# EAGLE design working (EAGLE 5.12)
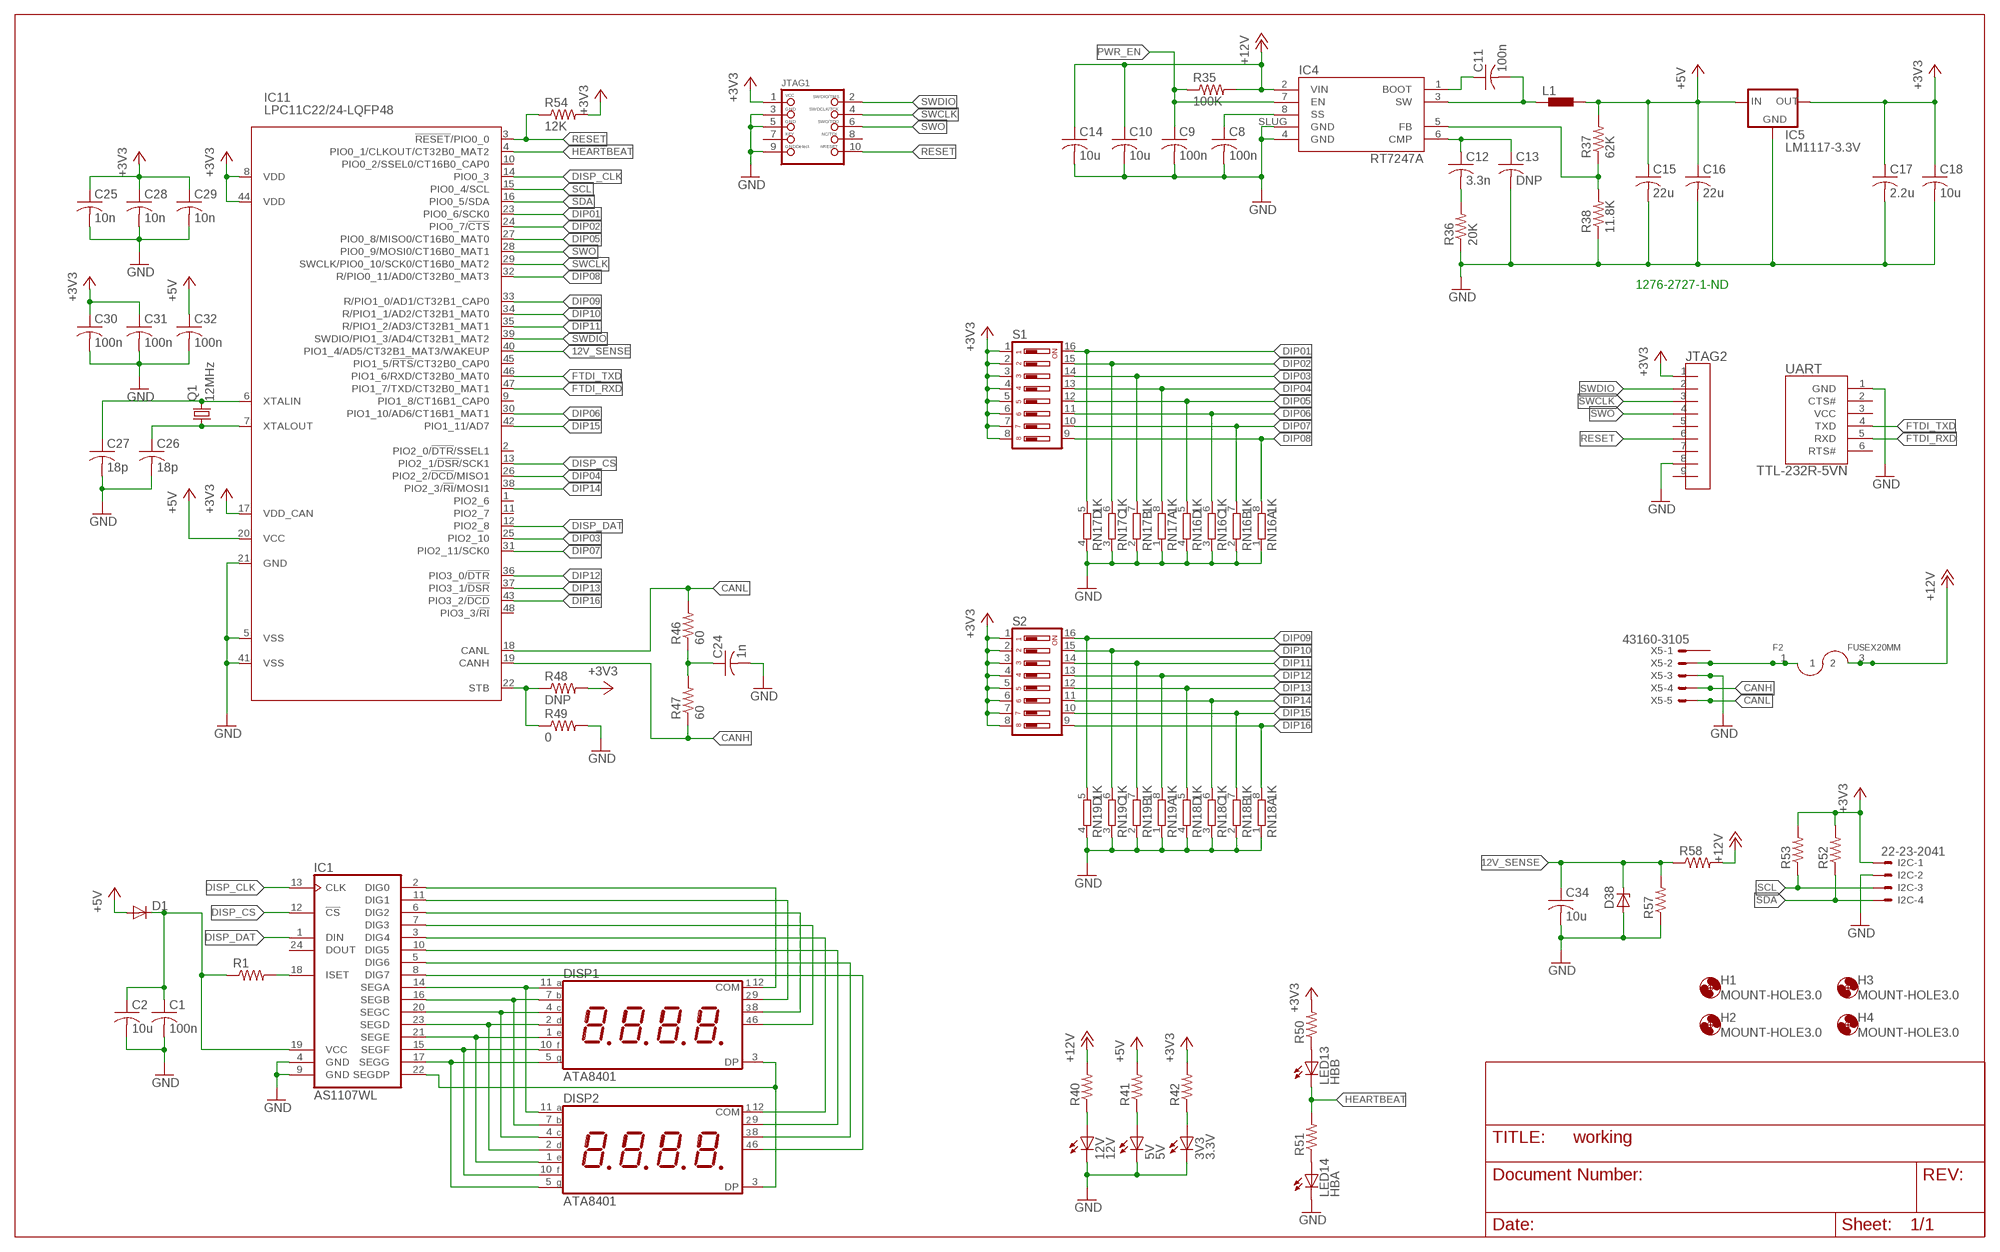
[diagram p0: schematic, sheet 1]

## Parts
3V3  3.3V  LEDCHIP-LED0805  [CHIP-LED0805]
5V  5V  LEDCHIP-LED0805  [CHIP-LED0805]
12V  12V  LEDCHIP-LED0805  [CHIP-LED0805]
C1  100n  C-USC0603  [C0603]
C2  10u  C-USC1206  [C1206]
C8  100n  C-USC0603  [C0603]
C9  100n  C-USC0603  [C0603]
C10  10u  C-USC1206  [C1206]
C11  100n  C-USC0603  [C0603]
C12  3.3n  C-USC0603  [C0603]
C13  DNP  C-USC0603  [C0603]
C14  10u  C-USC1206  [C1206]
C15  22u  C-USC1206  [C1206]
C16  22u  C-USC1206  [C1206]
C17  2.2u  C-USC0805  [C0805]
C18  10u  C-USC1206  [C1206]
C24  1n  C-USC0603  [C0603]
C25  10n  C-USC0603  [C0603]
C26  18p  C-USC0603  [C0603]
C27  18p  C-USC0603  [C0603]
C28  10n  C-USC0603  [C0603]
C29  10n  C-USC0603  [C0603]
C30  100n  C-USC0603  [C0603]
C31  100n  C-USC0603  [C0603]
C32  100n  C-USC0603  [C0603]
C34  10u  C-USC1206  [C1206]
D1  DIODESMA  [SMA-DIODE]
D38  ZENER-DIODESOD80C  [SOD80C]
DISP1  ATA8401  [ATA8401]
DISP2  ATA8401  [ATA8401]
F2  FUSEX20MM  [FUSE_5MM]
H1  MOUNT-HOLE3.0  [3,0]
H2  MOUNT-HOLE3.0  [3,0]
H3  MOUNT-HOLE3.0  [3,0]
H4  MOUNT-HOLE3.0  [3,0]
I2C  22-23-2041  [22-23-2041]
IC1  AS1107WL  [SOIC-24]
IC4  RT7247A  [SO08]
IC5  LM1117-3.3V  LM1117  [SOT223]
IC11  LPC11C22/24-LQFP48  [LQFP48]
JTAG1  JTAG-CORTEXM3  [2X05_1.27MM_SMT]
JTAG2  M09-100MIL  [100MIL-9]
L1  DR1030  [DR1030]
LED13  HBB  LEDCHIP-LED0805  [CHIP-LED0805]
LED14  HBA  LEDCHIP-LED0805  [CHIP-LED0805]
Q1  12MHz  CRYSTALHC49UP  [HC49UP]
R1  R-US_R0603  [R0603]
R35  100K  R-US_R0603  [R0603]
R36  20K  R-US_R0603  [R0603]
R37  62K  R-US_R0603  [R0603]
R38  11.8K  R-US_R0603  [R0603]
R40  R-US_R0603  [R0603]
R41  R-US_R0603  [R0603]
R42  R-US_R0603  [R0603]
R46  60  R-US_R0603  [R0603]
R47  60  R-US_R0603  [R0603]
R48  DNP  R-US_R0603  [R0603]
R49  0  R-US_R0603  [R0603]
R50  R-US_R0603  [R0603]
R51  R-US_R0603  [R0603]
R52  R-US_R0603  [R0603]
R53  R-US_R0603  [R0603]
R54  12K  R-US_R0603  [R0603]
R57  R-US_R0603  [R0603]
R58  R-US_R0603  [R0603]
RN16  1K  4R-NEXBS8V  [EXBS8V]
RN17  1K  4R-NEXBS8V  [EXBS8V]
RN18  1K  4R-NEXBS8V  [EXBS8V]
RN19  1K  4R-NEXBS8V  [EXBS8V]
S1  DS08  [DS-08]
S2  DS08  [DS-08]
UART  TTL-232R-5VN  [USBCABLE-0.100-NOLBL]
X5  43160-3105  [43160-XX05]

## Nets
12V_SENSE: C34.1 D38.C IC11.40(PIO1_4/AD5/CT32B1_MAT3/WAKEUP) R57.2 R58.1
+3V3: C17.1 C18.1 C25.1 C28.1 C29.1 C30.1 C31.1 I2C.1 IC5.2(OUT) IC11.8(VDD) IC11.17(VDD_CAN) IC11.44(VDD) JTAG1.1 JTAG2.1 R42.2 R48.2 R50.2 R52.2 R53.2 R54.2 S1.1 S1.2 S1.3 S1.4 S1.5 S1.6 S1.7 S1.8 S2.1 S2.2 S2.3 S2.4 S2.5 S2.6 S2.7 S2.8
+5V: C15.1 C16.1 C32.1 D1.A IC5.3(IN) IC11.20(VCC) L1.2 R37.2 R41.2
+12V: C10.1 C14.1 F2.3 F2.4(2B) IC4.2(VIN) R35.2 R40.2 R58.2
CANH: IC11.19(CANH) R47.1 X5.4@1(-4:S) X5.4@2(-4:S)
CANL: IC11.18(CANL) R46.2 X5.5@1(-5:S) X5.5@2(-5:S)
DIP01: IC11.23(PIO0_6/SCK0) RN17.5 S1.16
DIP02: IC11.24(PIO0_7/!CTS!) RN17.6 S1.15
DIP03: IC11.25(PIO2_10) RN17.7 S1.14
DIP04: IC11.26(PIO2_2/!DCD!/MISO1) RN17.8 S1.13
DIP05: IC11.27(PIO0_8/MISO0/CT16B0_MAT0) RN16.5 S1.12
DIP06: IC11.30(PIO1_10/AD6/CT16B1_MAT1) RN16.6 S1.11
DIP07: IC11.31(PIO2_11/SCK0) RN16.7 S1.10
DIP08: IC11.32(R/PIO0_11/AD0/CT32B0_MAT3) RN16.8 S1.9
DIP09: IC11.33(R/PIO1_0/AD1/CT32B1_CAP0) RN19.5 S2.16
DIP10: IC11.34(R/PIO1_1/AD2/CT32B1_MAT0) RN19.6 S2.15
DIP11: IC11.35(R/PIO1_2/AD3/CT32B1_MAT1) RN19.7 S2.14
DIP12: IC11.36(PIO3_0/!DTR!) RN19.8 S2.13
DIP13: IC11.37(PIO3_1/!DSR!) RN18.5 S2.12
DIP14: IC11.38(PIO2_3/!RI!/MOSI1) RN18.6 S2.11
DIP15: IC11.42(PIO1_11/AD7) RN18.7 S2.10
DIP16: IC11.43(PIO3_2/!DCD!) RN18.8 S2.9
DISP_CLK: IC1.13(CLK) IC11.14(PIO0_3)
DISP_CS: IC1.12(!CS) IC11.13(PIO2_1/!DSR!/SCK1)
DISP_DAT: IC1.1(DIN) IC11.12(PIO2_8)
FTDI_RXD: IC11.47(PIO1_7/TXD/CT32B0_MAT1) UART.5(RXD)
FTDI_TXD: IC11.46(PIO1_6/RXD/CT32B0_MAT0) UART.4(TXD)
GND: 3V3.C 5V.C 12V.C C1.2 C2.2 C8.2 C9.2 C10.2 C13.2 C14.2 C15.2 C16.2 C17.2 C18.2 C24.2 C25.2 C26.2 C27.2 C28.2 C29.2 C30.2 C31.2 C32.2 C34.2 D38.A I2C.2 IC1.4(GND) IC1.9(GND) IC4.4(GND) IC4.SLUG(GND) IC5.1(GND) IC11.5(VSS) IC11.21(GND) IC11.41(VSS) JTAG1.3 JTAG1.5 JTAG1.9 JTAG2.8 LED14.C R36.1 R38.1 R49.2 R57.1 RN16.1 RN16.2 RN16.3 RN16.4 RN17.1 RN17.2 RN17.3 RN17.4 RN18.1 RN18.2 RN18.3 RN18.4 RN19.1 RN19.2 RN19.3 RN19.4 UART.1(GND) X5.3@1(-3:S) X5.3@2(-3:S)
HEARTBEAT: IC11.4(PIO0_1/CLKOUT/CT32B0_MAT2) LED13.C R51.2
N$1: DISP1.11(A) DISP2.11(A) IC1.14(SEGA)
N$2: DISP1.7(B) DISP2.7(B) IC1.16(SEGB)
N$3: DISP1.4(C) DISP2.4(C) IC1.20(SEGC)
N$4: DISP1.2(D) DISP2.2(D) IC1.23(SEGD)
N$5: DISP1.1(E) DISP2.1(E) IC1.21(SEGE)
N$6: DISP1.10(F) DISP2.10(F) IC1.15(SEGF)
N$7: DISP1.5(G) DISP2.5(G) IC1.17(SEGG)
N$8: DISP1.3(DP) DISP2.3(DP) IC1.22(SEGDP)
N$9: IC1.18(ISET) R1.2
N$10: DISP1.12(COM1) IC1.2(DIG0)
N$11: DISP1.9(COM2) IC1.11(DIG1)
N$12: DISP1.8(COM3) IC1.6(DIG2)
N$13: DISP1.6(COM4) IC1.7(DIG3)
N$14: DISP2.12(COM1) IC1.3(DIG4)
N$15: DISP2.9(COM2) IC1.10(DIG5)
N$16: DISP2.8(COM3) IC1.5(DIG6)
N$17: DISP2.6(COM4) IC1.8(DIG7)
N$19: C1.1 C2.1 D1.C IC1.19(VCC) R1.1
N$69: F2.1 F2.2(1B) X5.2@1(-2:S) X5.2@2(-2:S)
N$91: 12V.A R40.1
N$92: C8.1 IC4.8(SS)
N$95: C11.1 IC4.1(BOOT)
N$96: C11.2 IC4.3(SW) L1.1
N$97: C12.1 C13.1 IC4.6(CMP)
N$98: C12.2 R36.2
N$99: IC4.5(FB) R37.1 R38.2
N$100: 5V.A R41.1
N$101: 3V3.A R42.1
N$103: IC11.22(STB) R48.1 R49.1
N$121: C26.1 IC11.7(XTALOUT) Q1.1
N$122: C24.1 R46.1 R47.2
N$123: C27.1 IC11.6(XTALIN) Q1.2
N$126: LED13.A R50.1
N$127: LED14.A R51.1
PWR_EN: C9.1 IC4.7(EN) R35.1
RESET: IC11.3(!RESET!/PIO0_0) JTAG1.10 JTAG2.6 R54.1
SCL: I2C.3 IC11.15(PIO0_4/SCL) R53.1
SDA: I2C.4 IC11.16(PIO0_5/SDA) R52.1
SWCLK: IC11.29(SWCLK/PIO0_10/SCK0/CT16B0_MAT2) JTAG1.4 JTAG2.3
SWDIO: IC11.39(SWDIO/PIO1_3/AD4/CT32B1_MAT2) JTAG1.2 JTAG2.2
SWO: IC11.28(PIO0_9/MOSI0/CT16B0_MAT1) JTAG1.6 JTAG2.4
Unconnected: IC1.24(DOUT) IC11.1(PIO2_6) IC11.2(PIO2_0/!DTR!/SSEL1) IC11.9(PIO1_8/CT16B1_CAP0) IC11.10(PIO0_2/SSEL0/CT16B0_CAP0) IC11.11(PIO2_7) IC11.45(PIO1_5/!RTS!/CT32B0_CAP0) IC11.48(PIO3_3/!RI!) JTAG1.7 JTAG1.8 JTAG2.5 JTAG2.7 JTAG2.9 UART.2(CTS#) UART.3(VCC) UART.6(RTS#) X5.1@1(-1:S) X5.1@2(-1:S)

## Notes on the sheet
- 1276-2727-1-ND

## Library data of the parts
3V3 5V 12V LED13 LED14 = led:LED: LED OSRAM: - CHIPLED LG R971, LG N971, LY N971, LG Q971, LY Q971, LO R971, LY R971 LH N974, LH R974 LS Q976, LO Q976, LY Q976 LO Q996 - Hyper CHIPLED LW Q18S LB Q993, LB Q99A, LB R99A - SideLED LS A670, LO A670, LY A670, LG A670, LP A670 LB A673, LV A673, LT A673, LW A673 LH A674 LY A675 LS A676, LA A676, LO A676, LY A676, LW A676 LS A679, LY A679, LG A679 - Hyper Micro SIDELED® LS Y876, LA Y876, LO Y876, LY Y876 LT Y87S - SmartLED LW L88C, LW L88S LB L89C, LB L89S, LG L890 LS L89K, LO L89K, LY L89K LS L896, LA L896, LO L896, LY L896 - TOPLED LS T670, LO T670, LY T670, LG T670, LP T670 LSG T670, LSP T670, LSY T670, LOP T670, LYG T670 LG T671, LOG T671, LSG T671 LB T673, LV T673, LT T673, LW T673 LH T674 LS T676, LA T676, LO T676, LY T676, LB T676, LH T676, LSB T676, LW T676 LB T67C, LV T67C, LT T67C, LS T67K, LO T67K, LY T67K, LW E67C LS E67B, LA E67B, LO E67B, LY E67B, LB E67C, LV E67C, LT E67C LW T67C LS T679, LY T679, LG T679 LS T770, LO T770, LY T770, LG T770, LP T770 LB T773, LV T773, LT T773, LW T773 LH T774 LS E675, LA E675, LY E675, LS T675 LS T776, LA T776, LO T776, LY T776, LB T776 LHGB T686 LT T68C, LB T68C - Hyper Mini TOPLED® LB M676 - Mini TOPLED Santana® LG M470 LS M47K, LO M47K, LY M47K Source: http://www.osram.convergy.de LUXEON: - LUMILED® LXK2-PW12-R00, LXK2-PW12-S00, LXK2-PW14-U00, LXK2-PW14-V00 LXK2-PM12-R00, LXK2-PM12-S00, LXK2-PM14-U00 LXK2-PE12-Q00, LXK2-PE12-R00, LXK2-PE12-S00, LXK2-PE14-T00, LXK2-PE14-U00 LXK2-PB12-K00, LXK2-PB12-L00, LXK2-PB12-M00, LXK2-PB14-N00, LXK2-PB14-P00, LXK2-PB14-Q00 LXK2-PR12-L00, LXK2-PR12-M00, LXK2-PR14-Q00, LXK2-PR14-R00 LXK2-PD12-Q00, LXK2-PD12-R00, LXK2-PD12-S00 LXK2-PH12-R00, LXK2-PH12-S00 LXK2-PL12-P00, LXK2-PL12-Q00, LXK2-PL12-R00 Source: www.luxeon.com KINGBRIGHT: KA-3528ASYC Source: www.kingbright.com
C1 C2 C8-C18 C24-C32 C34 = rcl:C-US: CAPACITOR, American symbol
D1 = SparkFun:DIODE: Diode These are standard reverse protection diodes and small signal diodes. SMA package can handle up to about 1A. SOD-323 can handle about 200mA. What the SOD-323 package when ordering, there are some mfgs out there that are 5-pin packages.
D38 = diode:ZENER-DIODE: Z-Diode
DISP1 DISP2 = rbg-sfe-sevenseg:ATA8401
F2 = SparkFun:FUSE
H1-H4 = holes:MOUNT-HOLE: MOUNTING HOLE with drill center marker
I2C = con-molex:22-23-2041: .100" (2.54mm) Center Header - 4 Pin; MF: MOLEX; MPN: 22-23-2041; OC_FARNELL: 1462920; OC_NEWARK: 38C0355
IC1 = rbg-ams-displaydrive:AS1107WL
IC4 = rbg-richtek-vreg:RT7247A
IC5 = v-reg-3:LM1117
IC11 = lpc1100v1.1:LPC11C22/24-LQFP48: NXP Semiconductors LPC11Cxx microcontrollers <http://ics.nxp.com/products/lpc1000/lpc11xx/lpc11cxx/> ARM 32-bit Cortex-M0 Microcontroller with MPU CPU clock up to 50MHz 32KByte on-chip Flash ROM with In-System Programming (ISP) and In-Application Programming (IAP) via On-Chip Bootloader 8KByte SRAM Nested Vectored Interrupt Controller 2 SPI controllers CAN controller On-chip, high-speed CAN transciever UART with full Modem Interface and RS485 Support Fast Mode I2C-Bus 4 Timers with 4 capture channels and 12 output channels Watchdog (WDT) Sytem tick timer 10-bit ADC with 8 channels Power Management Unit (PMU) Brownout detection 12MHz internal RC oscillator Serial Wire Debug/Trace port
JTAG1 = microbuilder:JTAG-CORTEXM3: Serial Wire (SW-DP) Connector This standard 0.05" 10-pin connector is for use with the Cortex M0/M3's native SWD (serial wire debugger) interface (SW-DP). Some boards support a 20-pin combined JTAG+SWD connector (SWJ-DP), such as the LPC1700 family, but many smaller devices only work with SWD which typically use the smaller 10-pin SW-DP connecter (the LPC1300 family, for example, only supports SWD). 2x05 1.27mm/0.05" Connector: This is the standard SMT connector defined by ARM for all Cortex devices, and should be used in most situations and for forward-compatibility since any new devices coming to market will likely use this connector. MOLEX 10 Pin 0.1" Connector: This 0.1" 10 pin connector has the same pin layout as the standard 0.05" connector, but is easier to work with if you are using standard jumper wires or custom cables to connect your SWD hardware. MOLEX 20 Pin 0.1" Connector: This 0.1" 20 pin connector is the same model used for ARM7/ARM9 JTAG debuggers, but is connected to match the pins on the Segger J-Link for ARM (which supports both JTAG and SWD debugging). See the following document from ARM for more information on Cortex M3 Debug Connectors: http://infocenter.arm.com/help/topic/com.arm.doc.faqs/attached/13634/cortex_debug_connectors.pdf And the following page for an overview with images of the different connector types: http://www.keil.com/peripherals/coresight/connectors.asp
JTAG2 = rbg-generic-headers:M09-100MIL
L1 = inductors:DR1030: DR1030 Series Low Profile Power Inductors Source: Data sheet <http://www.cooperbussmann.com/pdf/c73e479f-f867-4c64-ae26-9c1f23814163.pdf>
Q1 = crystal:CRYSTAL: CRYSTAL; OC_FARNELL: unknown; OC_NEWARK: unknown
R1 R35-R38 R40-R42 R46-R54 R57 R58 = rcl:R-US_: RESISTOR, American symbol
RN16-RN19 = resistor-dil:4R-N: Array Chip Resistor Source: RS Component / Phycomp; OC_FARNELL: unknown; OC_NEWARK: unknown
S1 S2 = switch-dil:DS08: DIL/CODE SWITCH; MPN: DS08; OC_FARNELL: unknown; OC_NEWARK: 73J0071
UART = rbg-ftdi-usb:TTL-232R-5V
X5 = con-molex:43160-*05: SDA-43160 Connector Source: http://www.molex.com/pdm_docs/sd/431601306_sd.pdf; MF: WALDOM/MOLEX; MPN: 43160-3105; OC_FARNELL: unknown; OC_NEWARK: 54H0267

## Net classes
1 HV: clearance 0.406 mm

## Board
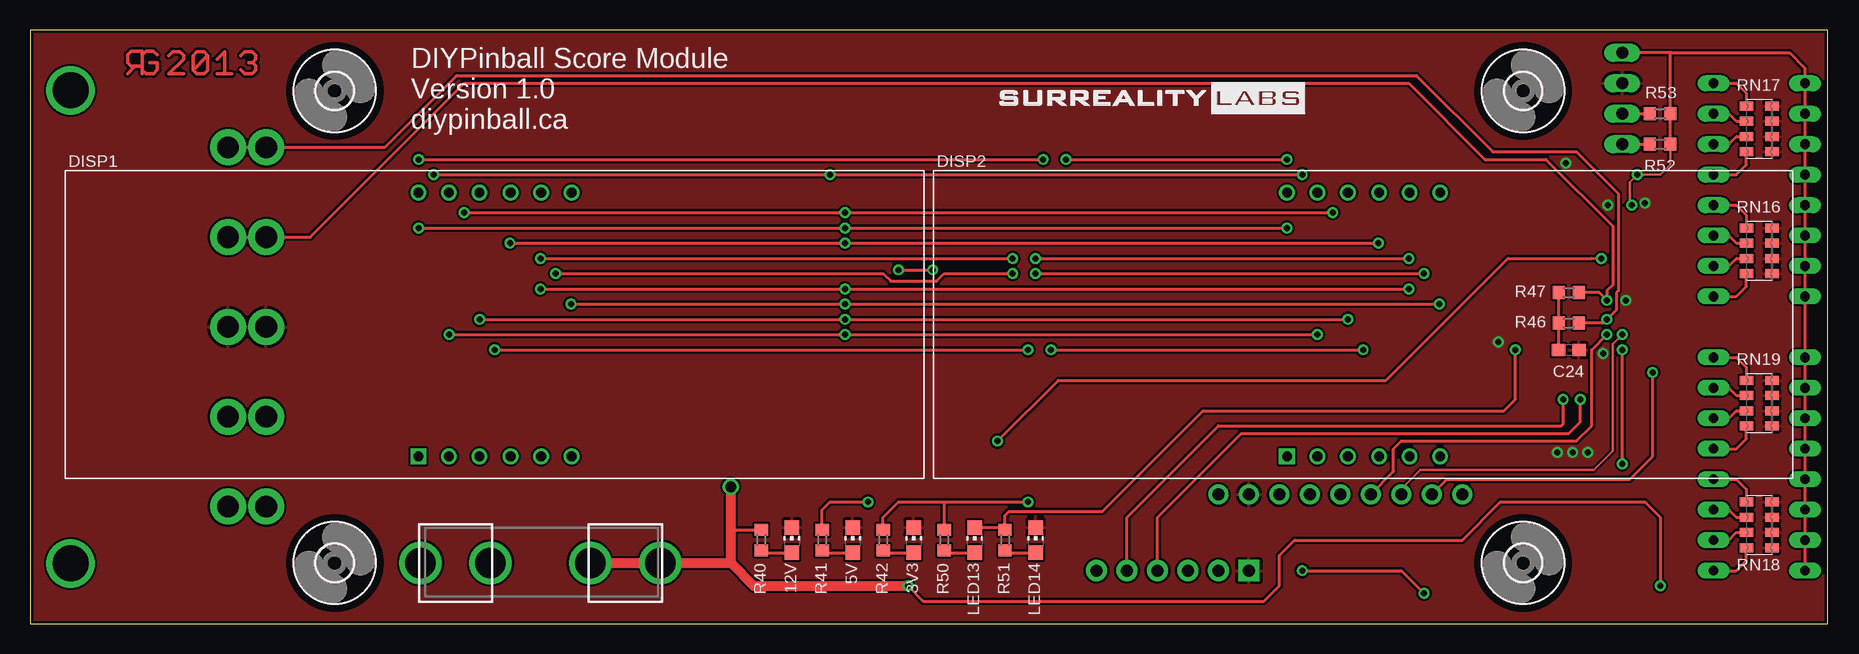
[diagram p1: board, top side]
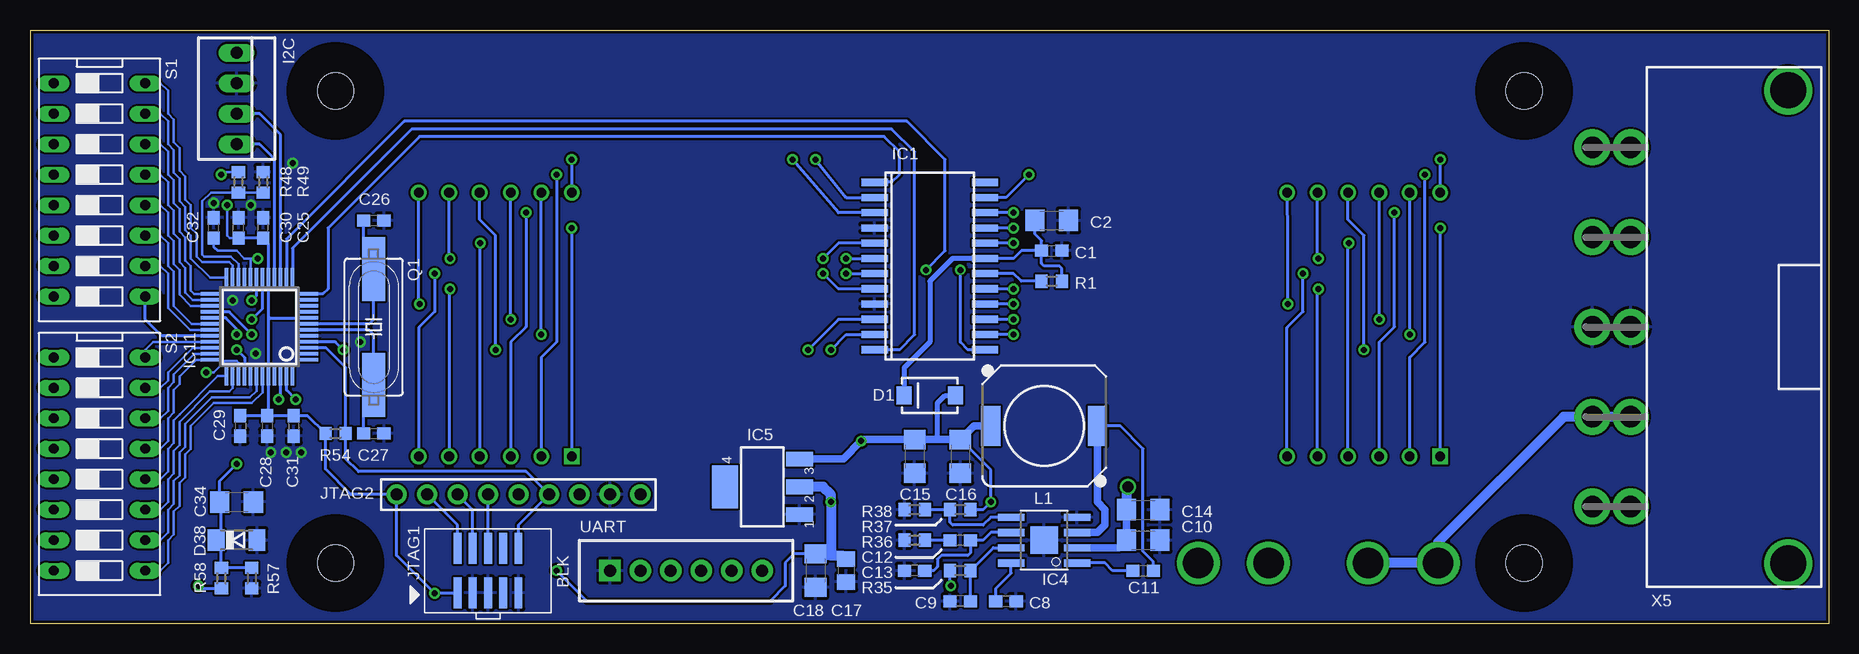
[diagram p2: board, bottom side, seen from below]

Size 149.86 x 49.53 mm. Coordinates in mm from the lower left corner, seen from the top.
Outline: 0,0 149.86,0 149.86,49.53 0,49.53 0,0
Copper layers (1*16): Top 0.035mm / dielectric 1.5mm / Bottom 0.035mm
Design rules "default *": minimum track width 8mil, minimum drill 19mil, track to track 7mil, track to pad 7mil, pad to pad 7mil, via to via 7mil, smd to smd 7mil, copper to edge 10mil, drill to drill 8mil, minimum pad ring 10mil, minimum via ring 8mil, stop-mask expansion 4mil, vias tented up to drill 20mil, thermal gap 10mil

### Footprints (pad centres in the part's own frame; a part is rotated, then mirrored left to right if it is on the bottom)
CHIP-LED0805 = smd 1.2 x 1.2: A 0,-1.05; C 0,1.05
C0603 = smd 1.1 x 1: 1 -0.85,0; 2 0.85,0
C1206 = smd 1.6 x 1.8: 1 -1.4,0; 2 1.4,0
C0805 = smd 1.3 x 1.5: 1 -0.95,0; 2 0.95,0
SMA-DIODE = smd 1.27 x 1.47: A -2.15,0; C 2.15,0
SOD80C = smd 1.4 x 1.8: A 1.7,0; C -1.7,0
ATA8401 = drill 0.8 square: 1 0,0 | drill 0.8 round: 2 2.54,0; 3 5.08,0; 4 7.68,0; 5 10.22,0; 6 12.76,0; 7 12.76,22; 8 10.22,22; 9 7.68,22; 10 5.08,22; 11 2.54,22; 12 0,22
FUSE_5MM = drill 2.54 pad 3.556 round: 1 0,-10; 2 0,-4.158; 3 0,4.158; 4 0,10
3,0 = hole 3: 0,0
22-23-2041 = drill 1 long: 1 -3.81,0; 2 -1.27,0; 3 1.27,0; 4 3.81,0
SOIC-24 = smd 0.6 x 2.2: 1 -6.985,-4.6; 2 -5.715,-4.6; 3 -4.445,-4.6; 4 -3.175,-4.6; 5 -1.905,-4.6; 6 -0.635,-4.6; 7 0.635,-4.6; 8 1.905,-4.6; 9 3.175,-4.6; 10 4.445,-4.6; 11 5.715,-4.6; 12 6.985,-4.6; 13 6.985,4.6; 14 5.715,4.6; 15 4.445,4.6; 16 3.175,4.6; 17 1.905,4.6; 18 0.635,4.6; 19 -0.635,4.6; 20 -1.905,4.6; 21 -3.175,4.6; 22 -4.445,4.6; 23 -5.715,4.6; 24 -6.985,4.6
SO08 = smd 0.61 x 2.21: 1 -1.905,-2.75; 2 -0.635,-2.75; 3 0.635,-2.75; 4 1.905,-2.75; 5 1.905,2.75; 6 0.635,2.75; 7 -0.635,2.75; 8 -1.905,2.75 | smd 2.3 x 2.3: SLUG 0,0
SOT223 = smd 1.219 x 2.235: 1 -2.311,-3.099; 2 0,-3.099; 3 2.311,-3.099 | smd 3.6 x 2.2: 4 0,3.099
LQFP48 = smd 0.3 x 1.6: 1 -2.75,-4.1; 2 -2.25,-4.1; 3 -1.75,-4.1; 4 -1.25,-4.1; 5 -0.75,-4.1; 6 -0.25,-4.1; 7 0.25,-4.1; 8 0.75,-4.1; 9 1.25,-4.1; 10 1.75,-4.1; 11 2.25,-4.1; 12 2.75,-4.1; 25 2.75,4.1; 26 2.25,4.1; 27 1.75,4.1; 28 1.25,4.1; 29 0.75,4.1; 30 0.25,4.1; 31 -0.25,4.1; 32 -0.75,4.1; 33 -1.25,4.1; 34 -1.75,4.1; 35 -2.25,4.1; 36 -2.75,4.1 | smd 1.6 x 0.3: 13 4.1,-2.75; 14 4.1,-2.25; 15 4.1,-1.75; 16 4.1,-1.25; 17 4.1,-0.75; 18 4.1,-0.25; 19 4.1,0.25; 20 4.1,0.75; 21 4.1,1.25; 22 4.1,1.75; 23 4.1,2.25; 24 4.1,2.75; 37 -4.1,2.75; 38 -4.1,2.25; 39 -4.1,1.75; 40 -4.1,1.25; 41 -4.1,0.75; 42 -4.1,0.25; 43 -4.1,-0.25; 44 -4.1,-0.75; 45 -4.1,-1.25; 46 -4.1,-1.75; 47 -4.1,-2.25; 48 -4.1,-2.75
2X05_1.27MM_SMT = smd 0.65 x 2.6: 1 -2.54,-1.85; 2 -2.54,1.85; 3 -1.27,-1.85; 4 -1.27,1.85; 5 0,-1.85; 6 0,1.85; 7 1.27,-1.85; 8 1.27,1.85; 9 2.54,-1.85; 10 2.54,1.85
100MIL-9 = drill 1 pad 1.676 round: 1 -10.16,0; 2 -7.62,0; 3 -5.08,0; 4 -2.54,0; 5 0,0; 6 2.54,0; 7 5.08,0; 8 7.62,0; 9 10.16,0
DR1030 = smd 3.3 x 1.6: 1 0,4.45; 2 0,-4.45
HC49UP = smd 5.334 x 1.93: 1 -4.826,0; 2 4.826,0
R0603 = smd 1 x 1.1: 1 -0.85,0; 2 0.85,0
EXBS8V = smd 0.75 x 1.1: 1 -1.905,-1.07; 2 -0.635,-1.07; 3 0.635,-1.07; 4 1.905,-1.07; 5 1.905,1.07; 6 0.635,1.07; 7 -0.635,1.07; 8 -1.905,1.07
DS-08 = drill 0.813 long: 1 -8.89,-3.81; 2 -6.35,-3.81; 3 -3.81,-3.81; 4 -1.27,-3.81; 5 1.27,-3.81; 6 3.81,-3.81; 7 6.35,-3.81; 8 8.89,-3.81; 9 8.89,3.81; 10 6.35,3.81; 11 3.81,3.81; 12 1.27,3.81; 13 -1.27,3.81; 14 -3.81,3.81; 15 -6.35,3.81; 16 -8.89,3.81
USBCABLE-0.100-NOLBL = drill 1 pad 1.778 square: 1 0,-7.62 | drill 1 pad 1.778 round: 2 0,-5.08; 3 0,-2.54; 4 0,0; 5 0,2.54; 6 0,5.08
43160-XX05 = drill 1.8 pad 3 round: 1@1 -14.98,0; 1@2 -14.98,3.18; 2@1 -7.49,0; 2@2 -7.49,3.18; 3@1 0,0; 3@2 0,3.18; 4@1 7.49,0; 4@2 7.49,3.18; 5@1 14.98,0; 5@2 14.98,3.18 | drill 3 pad 3.4 round: M1 -19.73,-13.13; M2 19.73,-13.13

### Placement (x,y rotation side)
3V3  73.66,6.99 0 top
5V  68.58,6.99 0 top
12V  63.5,6.99 0 top
C1  64.77,31.11 0 bottom
C2  64.77,33.66 0 bottom
C8  68.58,1.91 0 bottom
C9  72.39,1.91 180 bottom
C10  57.15,6.99 0 bottom
C11  57.15,4.45 0 bottom
C12  72.39,6.99 180 bottom
C13  76.2,4.45 180 bottom
C14  57.15,9.53 0 bottom
C15  76.2,13.97 270 bottom
C16  72.39,13.97 270 bottom
C17  81.92,4.45 270 bottom
C18  84.45,4.45 270 bottom
C24  128.27,22.86 0 top
C25  130.49,33.02 90 bottom
C26  121.28,33.66 0 bottom
C27  121.28,15.88 0 bottom
C28  130.18,16.51 270 bottom
C29  132.4,16.51 270 bottom
C30  132.56,33.02 90 bottom
C31  127.95,16.51 270 bottom
C32  134.62,33.02 90 bottom
C34  132.72,10.16 0 bottom
D1  74.93,19.05 180 bottom
D38  132.72,6.99 0 bottom
DISP1  32.38,13.97 0 top
DISP2  104.78,13.97 0 top
F2  42.55,5.08 270 top
H1  25.4,5.08 0 top
H2  124.46,5.08 0 top
H3  124.46,44.45 0 top
H4  25.4,44.45 0 top
I2C  132.72,43.81 270 bottom
IC1  74.93,29.84 270 bottom
IC4  65.41,6.99 90 bottom
IC5  88.9,11.43 90 bottom
IC11  130.81,24.77 90 bottom
JTAG1  111.76,4.45 0 bottom
JTAG2  109.22,10.79 0 bottom
L1  65.41,16.51 270 bottom
LED13  78.74,6.99 0 top
LED14  83.82,6.99 0 top
Q1  121.28,24.77 270 bottom
R1  64.77,28.57 180 bottom
R35  72.39,4.45 180 bottom
R36  76.2,6.99 0 bottom
R37  72.39,9.53 0 bottom
R38  76.2,9.53 0 bottom
R40  60.96,6.99 90 top
R41  66.04,6.99 90 top
R42  71.12,6.99 90 top
R46  128.27,25.08 0 top
R47  128.27,27.62 180 top
R48  132.56,36.83 90 bottom
R49  130.49,36.83 90 bottom
R50  76.2,6.99 90 top
R51  81.28,6.99 90 top
R52  135.89,40.01 0 top
R53  135.89,42.55 0 top
R54  124.46,15.88 180 bottom
R57  131.44,3.81 90 bottom
R58  133.99,3.81 270 bottom
RN16  144.15,31.11 90 top
RN17  144.15,41.27 90 top
RN18  144.15,8.26 90 top
RN19  144.15,18.41 90 top
S1  144.15,36.2 270 bottom
S2  144.15,13.34 270 bottom
U$1  [RGLOGO_SMALL_2013]  9.53,45.72 0 top
U$2  [SURREALITY_LOGO_SILK]  80.64,42.55 0 top
UART  93.98,4.45 270 bottom
X5  16.51,24.77 90 bottom

### Tracks (layer width: path | path; a pad name or v marks a point on that pad's centre or on a via)
12V_SENSE  (via drill 0.5)
  Top 0.254: v132.72,13.34 v132.72,22.86
  Bottom 0.254: IC11.40 132.06,22.2 v132.72,22.86 | R57.2 R58.1 133.99,6.55 D38.C 133.99,6.99 133.99,10.03 C34.1 134.12,11.94 v132.72,13.34
+3V3  (via drill 0.5)
  Top 0.203: v133.51,34.92 133.35,35.08 133.35,36.83 v133.99,37.47 135.89,37.47 136.74,38.31 R52.2
  Top 0.254: 136.84,47.62 146.69,47.62 147.96,46.35 S1.1 S1.2 S1.3 S1.4 S1.5 S1.6 S1.7 S1.8 S2.1 S2.2 S2.3 S2.4 S2.5 S2.6 S2.7 S2.8 | 136.84,47.62 I2C.1 | R52.2 R53.2 136.74,47.52 136.84,47.62 | v116.2,2.54 114.3,4.45 v106.05,4.45 | R42.2 71.12,8.89 72.39,10.16 76.2,10.16 | 76.2,10.16 v83.19,10.16 | 76.2,10.16 R50.2
  Bottom 0.203: C30.1 133.29,32.17 133.51,32.38 v133.51,34.92 | R48.2 133.77,37.68 v133.99,37.47
  Bottom 0.254: 130.06,25.4 IC11.44 130.06,17.48 C28.1 | 130.06,25.4 IC11.17 130.06,31.64 130.49,32.07 C25.1 C30.1 | IC11.8 129.94,25.52 130.06,25.4 | C28.1 C31.1 126.8,17.36 R54.2 125.31,12.91 123.19,10.79 JTAG2.1 119.38,5.71 v116.2,2.54 116.15,2.6 JTAG1.1 | C28.1 C29.1 | C18.1 86.23,5.84 87,5.08 87,3.17 88.27,1.91 103.5,1.91 v106.05,4.45
  Bottom 0.813: IC5.2 83.82,11.43 83.19,10.79 v83.19,10.16 83.19,5.71 | 83.19,5.71 84.33,5.71 C18.1 | 83.19,5.71 82.23,5.71 C17.1
+5V  (via drill 0.5)
  Top 0.203: 130.18,30.48 v130.97,30.48
  Top 0.254: R41.2 66.04,9.53 66.67,10.16 v69.85,10.16 | 130.18,30.48 123.19,30.48 113.03,20.32 85.72,20.32 v80.64,15.24
  Bottom 0.203: C32.1 134.62,31.43 134.3,31.11 132.72,31.11 132.08,30.48 131.6,30.48 | v130.97,30.48 131.6,30.48 | IC11.20 131.56,30.44 131.6,30.48
  Bottom 0.254: R37.2 70.48,9.53 v69.85,10.16 69.85,12.83 C16.1
  Bottom 0.406: D1.A 73.66,19.05 74.3,18.41 74.3,15.37
  Bottom 0.61: L1.2 71.25,16.51 C16.1 74.3,15.37 C15.1 80.52,15.37 v80.64,15.24 82.14,13.74 IC5.3
+12V  (via drill 0.5, 0.9)
  Top 0.254: v135.89,3.17 135.89,8.89 134.62,10.16 122.56,10.16 119.38,6.99 105.41,6.99 104.14,5.71 104.14,3.17 102.87,1.91 74.45,1.91 v73.18,3.17 | R40.2 58.77,7.83 58.55,7.62 58.55,6.64 58.42,6.51
  Top 0.813: F2.3 F2.4 58.42,5.08 | 58.42,5.08 58.42,6.51 v58.42,11.43 | v73.18,3.17 60.33,3.17 58.42,5.08
  Bottom 0.254: R35.2 73.24,3.23 v73.18,3.17 | R58.2 135.68,2.96 v135.89,3.17
  Bottom 0.61: IC4.2 59.19,6.35 C10.1 C14.1
  Bottom 0.813: C14.1 58.55,11.3 v58.42,11.43
CANH  (via drill 0.5)
  Top 0.254: X5.4@1 X5.4@2 23.36,32.26 36.2,45.09 114.94,45.09 121.28,38.73 126.36,38.73 131.92,33.18 131.92,28.26 131.44,27.78 v131.44,26.99 130.81,27.62 R47.1
  Bottom 0.254: IC11.19 131.06,27.37 v131.44,26.99
CANL  (via drill 0.5)
  Top 0.254: X5.5@1 X5.5@2 29.59,39.74 35.56,45.72 115.57,45.72 121.92,39.37 128.91,39.37 132.4,35.88 132.4,27.78 132.24,27.62 132.24,26.19 v131.44,25.4 131.13,25.08 R46.2
  Bottom 0.254: IC11.18 130.56,26.29 v131.44,25.4
DIP01
  Top 0.254: RN17.5 143.07,44.25 142.24,45.09 S1.16
  Bottom 0.203: IC11.23 133.06,29.87 133.35,30.16 135.57,30.16 136.05,30.64 136.05,32.54 136.53,33.02 136.53,34.92 137,35.4 137,37.31 137.48,37.78 137.48,39.69 137.95,40.16 137.95,42.07 138.43,42.55 138.43,44.45 139.06,45.09 S1.16
DIP02
  Top 0.254: RN17.6 142.24,41.91 141.6,42.55 S1.15
  Bottom 0.203: IC11.24 134.91,28.86 136.53,30.48 136.53,32.38 137,32.86 137,34.77 137.48,35.24 137.48,37.15 137.95,37.62 137.95,39.53 138.43,40.01 138.43,41.91 139.06,42.55 S1.15
DIP03
  Top 0.254: RN17.7 142.24,40.64 141.6,40.01 S1.14
  Bottom 0.203: IC11.25 136.26,27.52 136.53,27.78 136.53,29.84 137,30.32 137,32.23 137.48,32.7 137.48,34.61 137.95,35.08 137.95,36.99 138.43,37.47 138.43,39.37 139.06,40.01 S1.14
DIP04
  Top 0.254: RN17.8 143.07,38.3 142.24,37.47 S1.13
  Bottom 0.203: IC11.26 136.39,27.02 137,27.62 137,29.69 137.48,30.16 137.48,32.07 137.95,32.54 137.95,34.45 138.43,34.92 138.43,36.83 139.06,37.47 S1.13
DIP05
  Top 0.254: RN16.5 143.07,34.09 142.24,34.92 S1.12
  Bottom 0.203: IC11.27 136.53,26.52 137.48,27.46 137.48,29.53 137.95,30 137.95,31.91 138.43,32.38 138.43,34.29 139.06,34.92 S1.12
DIP06
  Top 0.254: RN16.6 142.24,31.75 141.6,32.38 S1.11
  Bottom 0.203: IC11.30 136.46,25.02 137.95,26.51 137.95,29.37 138.43,29.84 138.43,31.75 139.06,32.38 S1.11
DIP07
  Top 0.254: RN16.7 142.24,30.48 141.6,29.84 S1.10
  Bottom 0.203: IC11.31 136.59,24.52 138.43,26.35 138.43,29.21 139.06,29.84 S1.10
DIP08
  Top 0.254: RN16.8 143.07,28.14 142.24,27.3 S1.9
  Bottom 0.254: IC11.32 138.95,24.02 140.34,25.4 S1.9
DIP09
  Top 0.254: RN19.5 143.07,21.39 142.24,22.23 S2.16
  Bottom 0.203: IC11.33 139.68,23.52 140.34,22.86 S2.16
DIP10
  Top 0.254: RN19.6 142.24,19.05 141.6,19.68 S2.15
  Bottom 0.203: S2.15 139.06,19.68 138.43,20.32 138.43,20.95 136.37,23.02 IC11.34
DIP11
  Top 0.254: RN19.7 142.24,17.78 141.6,17.14 S2.14
  Bottom 0.203: IC11.35 136.24,22.52 137.95,20.8 137.95,20.16 138.43,19.68 138.43,17.78 139.06,17.14 S2.14
DIP12
  Top 0.254: RN19.8 143.07,15.44 142.24,14.61 S2.13
  Bottom 0.203: IC11.36 136.1,22.02 137.48,20.64 137.48,20 137.95,19.53 137.95,17.62 138.43,17.14 138.43,15.24 139.06,14.61 S2.13
DIP13
  Top 0.254: RN18.5 143.07,11.23 142.24,12.06 S2.12
  Bottom 0.203: S2.12 139.06,12.06 138.43,12.7 138.43,14.61 137.95,15.08 137.95,16.99 137.48,17.46 134.28,20.66 IC11.37
DIP14
  Top 0.254: RN18.6 142.24,8.89 141.6,9.53 S2.11
  Bottom 0.203: IC11.38 133.06,19.66 133.35,19.37 134.94,19.37 137.48,16.83 137.48,14.92 137.95,14.45 137.95,12.54 138.43,12.06 138.43,10.16 139.06,9.53 S2.11
DIP15
  Top 0.254: RN18.7 142.24,7.62 141.6,6.99 S2.10
  Bottom 0.203: IC11.42 131.06,19.43 131.6,18.89 134.78,18.89 137,16.67 137,14.76 137.48,14.29 137.48,12.38 137.95,11.91 137.95,10 138.43,9.53 138.43,7.62 139.06,6.99 S2.10
DIP16
  Top 0.254: RN18.8 143.07,5.28 142.24,4.45 S2.9
  Bottom 0.203: IC11.43 130.56,19.3 131.44,18.41 134.62,18.41 136.53,16.51 136.53,14.61 137,14.13 137,12.22 137.48,11.75 137.48,9.84 137.95,9.37 137.95,7.46 138.43,6.99 138.43,5.08 139.06,4.45 S2.9
DISP_CLK  (via drill 0.5)
  Top 0.254: v72.39,29.53 v75.25,29.53
  Bottom 0.254: IC11.14 128.56,32.09 118.75,41.91 76.83,41.91 73.66,38.73 73.66,31.11 v75.25,29.53 | v72.39,29.53 72.39,23.5 71.75,22.86 IC1.13
DISP_CS
  Bottom 0.254: IC11.13 128.06,31.32 118.11,41.27 78.11,41.27 76.2,39.37 76.2,24.13 77.47,22.86 IC1.12
DISP_DAT
  Bottom 0.254: IC11.12 125.52,27.52 125.09,27.94 125.09,33.02 117.47,40.64 78.74,40.64 77.47,39.37 77.47,37.47 78.11,36.83 IC1.1
FTDI_RXD  (via drill 0.5)
  Top 0.254: v127.79,18.73 127.79,16.67 127.64,16.51 99.06,16.51 91.44,8.89 UART.5
  Bottom 0.254: IC11.47 128.56,19.5 v127.79,18.73
FTDI_TXD  (via drill 0.5)
  Top 0.254: v129.22,18.73 129.22,16.83 128.27,15.88 100.97,15.88 93.98,8.89 UART.4
  Bottom 0.254: IC11.46 129.06,18.89 v129.22,18.73
GND  (via drill 0.5)
  other vias: 131.13,22.54 129.86,14.29 128.59,14.29 127.32,14.29 122.4,23.5 133.03,26.99 134.62,35.08 131.52,34.93 128.03,38.42
  pour Bottom: -1.27,51.44 151.76,51.44 151.76,-1.91 -1.27,-1.91
  pour Top: -1.27,51.44 151.76,51.44 151.76,-1.91 -1.27,-1.91
HEARTBEAT  (via drill 0.5)
  Top 0.254: LED13.C 81.08,8.04 R51.2 81.28,9.05 81.6,9.37 89.38,9.37 97.79,17.78 122.87,17.78 123.83,18.73 v123.83,22.86
  Bottom 0.254: IC11.4 124.48,23.52 v123.83,22.86
N$1  (via drill 0.5)
  Top 0.254: v34.92,24.13 v67.94,24.13 v107.31,24.13
  Bottom 0.254: v34.92,24.13 DISP1.11 | v107.31,24.13 DISP2.11 | v67.94,24.13 IC1.14
N$2  (via drill 0.5)
  Top 0.254: v45.09,26.67 v67.94,26.67 v117.47,26.67
  Bottom 0.254: DISP1.7 45.09,33.43 v45.09,26.67 | v67.94,26.67 IC1.16 | DISP2.7 117.53,26.73 v117.47,26.67
N$3  (via drill 0.5)
  Top 0.254: v40.01,31.75 v67.94,31.75 v112.39,31.75
  Bottom 0.254: DISP1.4 40.06,31.69 v40.01,31.75 | v67.94,31.75 IC1.20 | DISP2.4 112.45,31.69 v112.39,31.75
N$4  (via drill 0.5)
  Top 0.254: v33.66,37.47 v66.67,37.47 v106.05,37.47
  Bottom 0.254: DISP1.2 34.92,22.23 33.66,23.5 v33.66,37.47 | v66.67,37.47 68.58,35.56 IC1.23 | DISP2.2 107.31,22.23 106.05,23.5 v106.05,37.47
N$5  (via drill 0.5)
  Top 0.254: v32.38,33.02 v67.94,33.02 v104.78,33.02
  Bottom 0.254: DISP1.1 v32.38,33.02 | v67.94,33.02 IC1.21 | v104.78,33.02 DISP2.1
N$6  (via drill 0.5)
  Top 0.254: v37.47,25.4 v67.94,25.4 v109.86,25.4
  Bottom 0.254: v67.94,25.4 IC1.15 | v37.47,25.4 DISP1.10 | v109.86,25.4 DISP2.10
N$7  (via drill 0.5)
  Top 0.254: v42.55,27.94 v67.94,27.94 v114.94,27.94
  Bottom 0.254: DISP1.5 42.6,27.88 v42.55,27.94 | v67.94,27.94 IC1.17 | DISP2.5 115,27.88 v114.94,27.94
N$8  (via drill 0.5)
  Top 0.254: v36.2,34.29 v67.94,34.29 v108.58,34.29
  Bottom 0.254: DISP1.3 37.47,23.5 36.2,24.77 v36.2,34.29 | v67.94,34.29 IC1.22 | DISP2.3 109.86,23.5 108.58,24.77 v108.58,34.29
N$9
  Bottom 0.254: R1.2 67.31,28.57 67.94,29.21 IC1.18
N$10  (via drill 0.5)
  Top 0.254: v32.38,38.73 v84.45,38.73
  Bottom 0.254: IC1.2 81.92,35.56 v84.45,38.73 | DISP1.12 v32.38,38.73
N$11  (via drill 0.5)
  Top 0.254: v38.73,22.86 v83.19,22.86
  Bottom 0.254: IC1.11 81.92,24.13 v83.19,22.86 | v38.73,22.86 38.73,32.38 40.06,33.72 DISP1.9
N$12  (via drill 0.5)
  Top 0.254: v42.55,30.48 v81.92,30.48
  Bottom 0.254: v81.92,30.48 IC1.6 | DISP1.8 42.6,30.54 v42.55,30.48
N$13  (via drill 0.5)
  Top 0.254: v43.81,29.21 71.12,29.21 71.75,28.57 75.56,28.57 76.2,29.21 v81.92,29.21
  Bottom 0.254: v81.92,29.21 IC1.7 | v43.81,29.21 43.81,26.04 45.15,24.7 DISP1.6
N$14  (via drill 0.5)
  Top 0.254: v86.36,38.73 v104.78,38.73
  Bottom 0.254: IC1.3 82.55,34.29 v86.36,38.73 | v104.78,38.73 DISP2.12
N$15  (via drill 0.5)
  Top 0.254: v85.09,22.86 v111.12,22.86
  Bottom 0.254: IC1.10 82.55,25.4 v85.09,22.86 | v111.12,22.86 111.12,32.38 112.45,33.72 DISP2.9
N$16  (via drill 0.5)
  Top 0.254: v83.82,30.48 v114.94,30.48
  Bottom 0.254: IC1.5 82.55,31.75 v83.82,30.48 | DISP2.8 115,30.54 v114.94,30.48
N$17  (via drill 0.5)
  Top 0.254: v83.82,29.21 v116.2,29.21
  Bottom 0.254: DISP2.6 117.53,24.7 116.2,26.04 v116.2,29.21 | v83.82,29.21 82.55,27.94 IC1.8
N$19
  Bottom 0.254: IC1.19 67.94,30.48 67.31,31.11 C1.1 | R1.1 63.92,29.63 64.14,29.84 65.41,29.84 65.62,30.06 C1.1 | C1.1 65.62,31.96 66.17,32.52 C2.1
  Bottom 0.406: D1.C 77.08,21.34 74.93,23.5 74.93,28.57 73.03,30.48 IC1.19
N$69
  Bottom 0.813: X5.2@1 X5.2@2 22.09,17.27 32.55,6.83 F2.1 F2.2
N$91
  Top 0.254: 12V.A 61.16,5.93 R40.1
N$92
  Bottom 0.254: IC4.8 68.16,4.24 69.43,2.96 C8.1
N$95
  Bottom 0.254: IC4.1 60.33,5.08 59.69,4.45 C11.1
N$96
  Bottom 0.254: C11.2 56.3,5.18 57.15,6.03 57.15,14.61 59.05,16.51 L1.1
  Bottom 0.61: IC4.3 60.96,7.62 60.33,8.26 60.33,9.53 60.96,10.16 L1.1
N$97
  Bottom 0.254: C13.1 74.61,4.45 74.3,4.76 74.3,5.4 73.98,5.71 71.75,5.71 71.54,5.93 C12.1 70.48,6.99 69.85,7.62 IC4.6
N$98
  Bottom 0.254: C12.2 R36.2
N$99
  Bottom 0.254: R38.2 R37.1 73.24,8.47 73.03,8.26 70.48,8.26 69.85,8.89 IC4.5
N$100
  Top 0.254: 5V.A 66.24,5.93 R41.1
N$101
  Top 0.254: 3V3.A 71.32,5.93 R42.1
N$103
  Bottom 0.203: IC11.22 132.56,30.01 133.19,30.64 135.41,30.64 135.57,30.8 135.57,35.24 134.84,35.98 R48.1 R49.1
N$121
  Bottom 0.254: IC11.7 121.67,25.02 121.28,25.4 Q1.1 122.14,30.44 C26.1
N$122
  Top 0.254: C24.1 R46.1 R47.2
N$123
  Bottom 0.254: IC11.6 121.67,24.52 121.28,24.13 Q1.2 122.14,19.09 C27.1
N$126
  Top 0.254: LED13.A 76.4,5.93 R50.1
N$127
  Top 0.254: LED14.A 81.48,5.93 R51.1
PWR_EN
  Bottom 0.254: C9.1 R35.1 69.64,6.35 IC4.7
RESET
  Bottom 0.254: IC11.3 125.25,23.02 123.61,21.38 R54.1 123.61,13.76 122.56,12.7 108.58,12.7 JTAG2.6 109.22,8.26 JTAG1.10
SCL
  Top 0.254: I2C.3 R53.1
  Bottom 0.254: IC11.15 129.06,40.8 130.81,42.55 I2C.3
SDA
  Top 0.254: I2C.4 R52.1
  Bottom 0.254: IC11.16 129.56,38.76 130.81,40.01 I2C.4
SWCLK  (via drill 0.5)
  Top 0.203: v132.72,24.13 131.92,23.34 131.92,14.45 130.33,12.86 115.89,12.86 114.3,11.27 JTAG2.3
  Bottom 0.254: JTAG1.4 113.03,9.53 JTAG2.3 | IC11.29 133.62,25.52 132.72,24.61 v132.72,24.13
SWDIO  (via drill 0.5)
  Top 0.254: JTAG2.2 118.11,12.06 133.35,12.06 135.25,13.97 v135.25,20.95
  Bottom 0.203: IC11.39 132.56,21.75 132.72,21.91 133.67,21.91 134.62,20.95 v135.25,20.95
  Bottom 0.254: JTAG1.2 114.3,8.26 JTAG2.2
SWO  (via drill 0.5)
  Top 0.254: v131.44,24.13 130.18,22.86 130.18,16.51 128.91,15.24 114.3,15.24 113.67,14.61 113.67,12.7 JTAG2.4
  Bottom 0.254: JTAG1.6 JTAG2.4 | IC11.28 133.33,26.02 v131.44,24.13

### Text on the board
tNames: DIYPinball Score Module | Version 1.0 | diypinball.ca